# Altium project 300W ELECTRONIC LOAD WITH LM324.PrjPcb
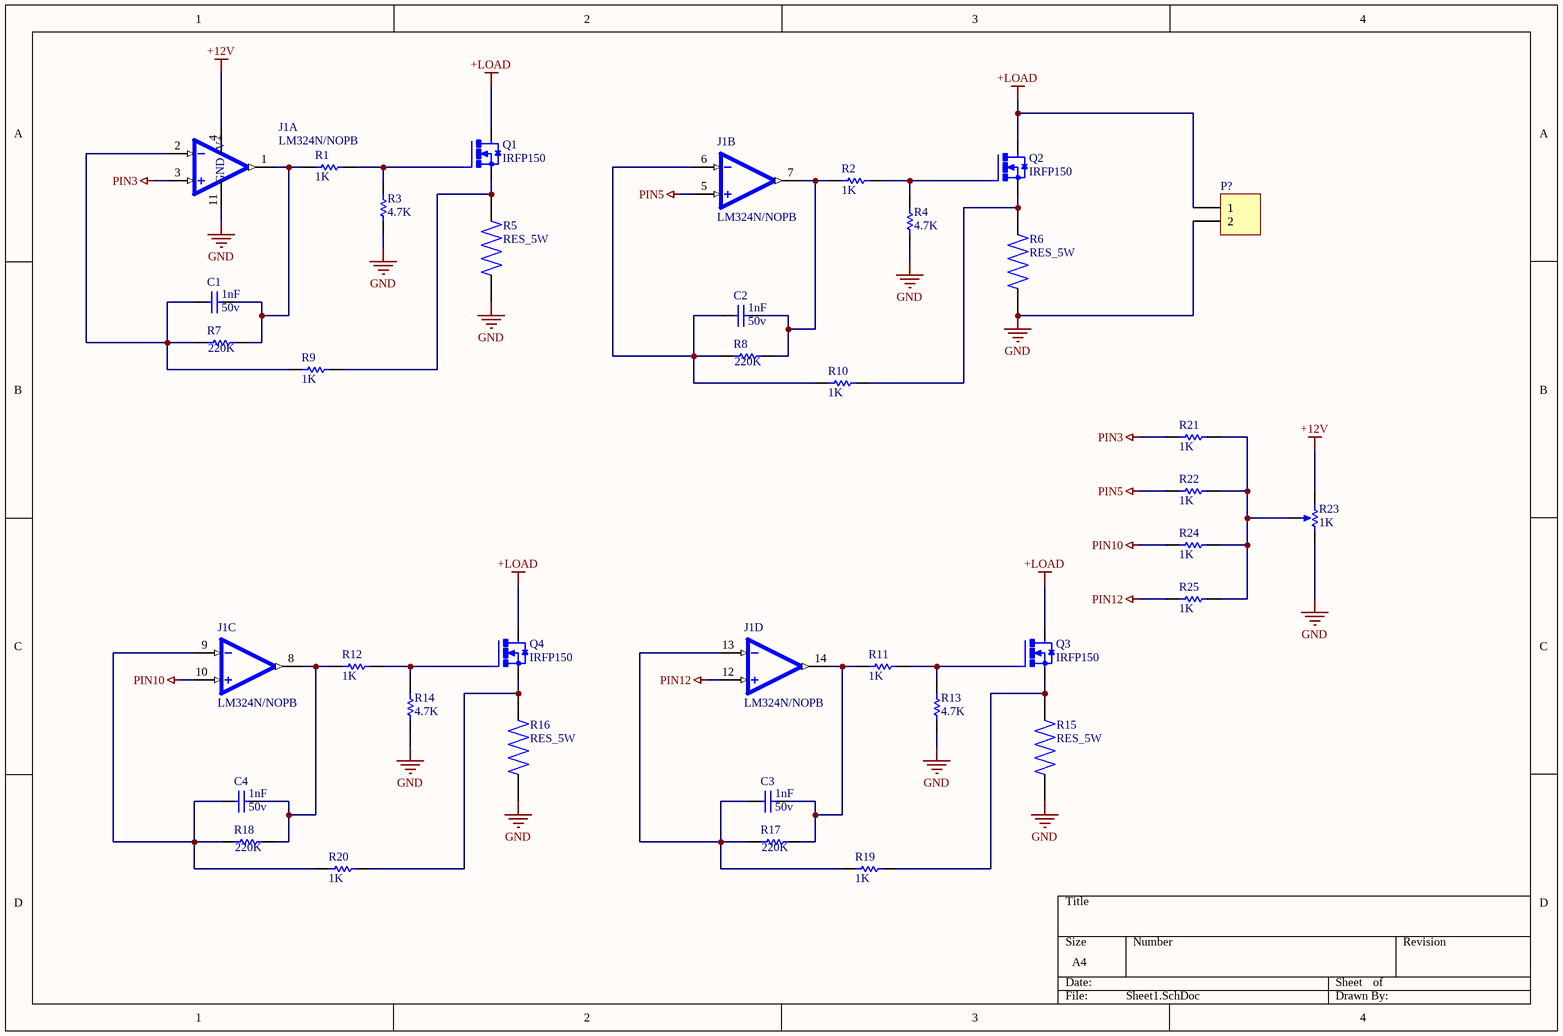
[diagram p0: Sheet1.SchDoc]
1 sheet, 35 parts. Net scope: global (net labels, ports and power ports of the same name join across sheets).
Board file: TH PCB.PcbDoc

## Sheet Sheet1.SchDoc
size A4; SheetNumber: 1; SheetTotal: 1

### Parts
C1  Volte: 50v  [My_cap100n]  (hidden comment: 1nF)
C2  Volte: 50v  [My_cap100n]  (hidden comment: 1nF)
C3  Volte: 50v  [My_cap100n]  (hidden comment: 1nF)
C4  Volte: 50v  [My_cap100n]  (hidden comment: 1nF)
J1  LM324N/NOPB  [DIP825W47P254L1917H533Q14]  (parts A,B,C,D of 4)
P?  Header 2  [My_ Power_Connector]  (value not drawn)
Q1  IRFP150  [TO247BV]
Q2  IRFP150  [TO247BV]
Q3  IRFP150  [TO247BV]
Q4  IRFP150  [TO247BV]
R1  1K  [R10K_10mm_TH_my]
R2  1K  [R10K_10mm_TH_my]
R3  4.7K  [R3.3k_10mm_TH_my]
R4  4.7K  [R3.3k_10mm_TH_my]
R5  RES_5W  [RES_5W]
R6  RES_5W  [RES_5W]
R7  220K  [R100K_10MM_Th]
R8  220K  [R100K_10MM_Th]
R9  1K  [R10K_10mm_TH_my]
R10  1K  [R10K_10mm_TH_my]
R11  1K  [R10K_10mm_TH_my]
R12  1K  [R10K_10mm_TH_my]
R13  4.7K  [R3.3k_10mm_TH_my]
R14  4.7K  [R3.3k_10mm_TH_my]
R15  RES_5W  [RES_5W]
R16  RES_5W  [RES_5W]
R17  220K  [R100K_10MM_Th]
R18  220K  [R100K_10MM_Th]
R19  1K  [R10K_10mm_TH_my]
R20  1K  [R10K_10mm_TH_my]
R21  1K  [R10K_10mm_TH_my]
R22  1K  [R10K_10mm_TH_my]
R23  1K  [MY_TRIM_POT]
R24  1K  [R10K_10mm_TH_my]
R25  1K  [R10K_10mm_TH_my]

### Nets
+12V: J1.4(V+) R23.1(TOP)
+LOAD: P?.1 Q1.D Q2.D Q3.D Q4.D
GND: J1.11(GND) P?.2 R3.2 R4.2 R5.2 R6.2 R13.2 R14.2 R15.2 R16.2 R23.2(BOT)
PIN3: J1.3(1IN+) R21.1
PIN5: J1.5(2IN+) R22.1
PIN10: J1.10(3IN+) R24.1
PIN12: J1.12(4IN+) R25.1
NetC1_1: C1.1 J1.2(1IN-) R7.1 R9.1
NetC1_2: C1.2 J1.1(1OUT) R1.1 R7.2
NetC2_1: C2.1 J1.6(2IN-) R8.1 R10.1
NetC2_2: C2.2 J1.7(2OUT) R2.1 R8.2
NetC3_1: C3.1 J1.13(4IN-) R17.1 R19.1
NetC3_2: C3.2 J1.14(4OUT) R11.1 R17.2
NetC4_1: C4.1 J1.9(3IN-) R18.1 R20.1
NetC4_2: C4.2 J1.8(3OUT) R12.1 R18.2
NetQ1_G: Q1.G R1.2 R3.1
NetQ1_S: Q1.S R5.1 R9.2
NetQ2_G: Q2.G R2.2 R4.1
NetQ2_S: Q2.S R6.1 R10.2
NetQ3_G: Q3.G R11.2 R13.1
NetQ3_S: Q3.S R15.1 R19.2
NetQ4_G: Q4.G R12.2 R14.1
NetQ4_S: Q4.S R16.1 R20.2
NetR21_2: R21.2 R22.2 R23.3(TAP) R24.2 R25.2

### Library data of the parts
C1-C4 = Cap ceramic: None polar capacitor; ASiD Part Number: C-AS; Value: 1nF
J1 = LM324N/NOPB: Quad 30-V 1.2-MHz operational amplifier; MF: Texas Instruments; MP: LM324N; SnapEDA_Link: https://www.snapeda.com/parts/LM324N/Texas+Instruments/view-part/?ref=snap; Package: PDIP-14 Texas Instruments; Value: *; Check_prices: https://www.snapeda.com/parts/LM324N/Texas+Instruments/view-part/?ref=eda
P? = Header 2: Header, 2-Pin; ASiD Part Number: Header 2-AS
Q1-Q4 = IRFP150: N-Channel 100V 41A _Tc_ 230W _Tc_ Through Hole TO-247-3; MF: Vishay Siliconix; Package: TO-247 Vishay Siliconix; Price: None; SnapEDA_Link: https://www.snapeda.com/parts/IRFP150/Vishay%20Siliconix/view-part/2883493/?ref=snap; Availability: Unavailable; Value: *; MP: IRFP150
R1-R4 R7-R14 R17-R22 R24 R25 = Res: Standard resistor; ASiD Part Number: Res-AS
  R1 R2 R9-R12 R19-R22 R24 R25: Value: 1K
  R3 R4 R13 R14: Value: 4.7K
  R7 R8 R17 R18: Value: 220K
R5 R6 R15 R16 = RES_5W: 27 Ohm ±5% 5W AÃ§Ä±k Delikli DirenÃ§ Eksenel Aleve DayanÄ±klÄ±, Darbeye DayanÄ±klÄ±, GÃ¼venlik Ã‡imento; MF: Yageo; MP: SQP500JB-27R; SnapEDA_Link: https://www.snapeda.com/parts/SQP500JB-27R/Yageo/view-part/?ref=snap; Package: None; Value: *; Check_prices: https://www.snapeda.com/parts/SQP500JB-27R/Yageo/view-part/?ref=eda
R23 = Variable Resistor: Potentiometer; ASiD Part Number: Variable Resistor-AS; Value: 1K